# Altium project HU_revB.PrjPcb (part 4 of 4)

## Sheet PWR_SW.SchDoc
size A4; SheetNumber: 15; SheetTotal: 17
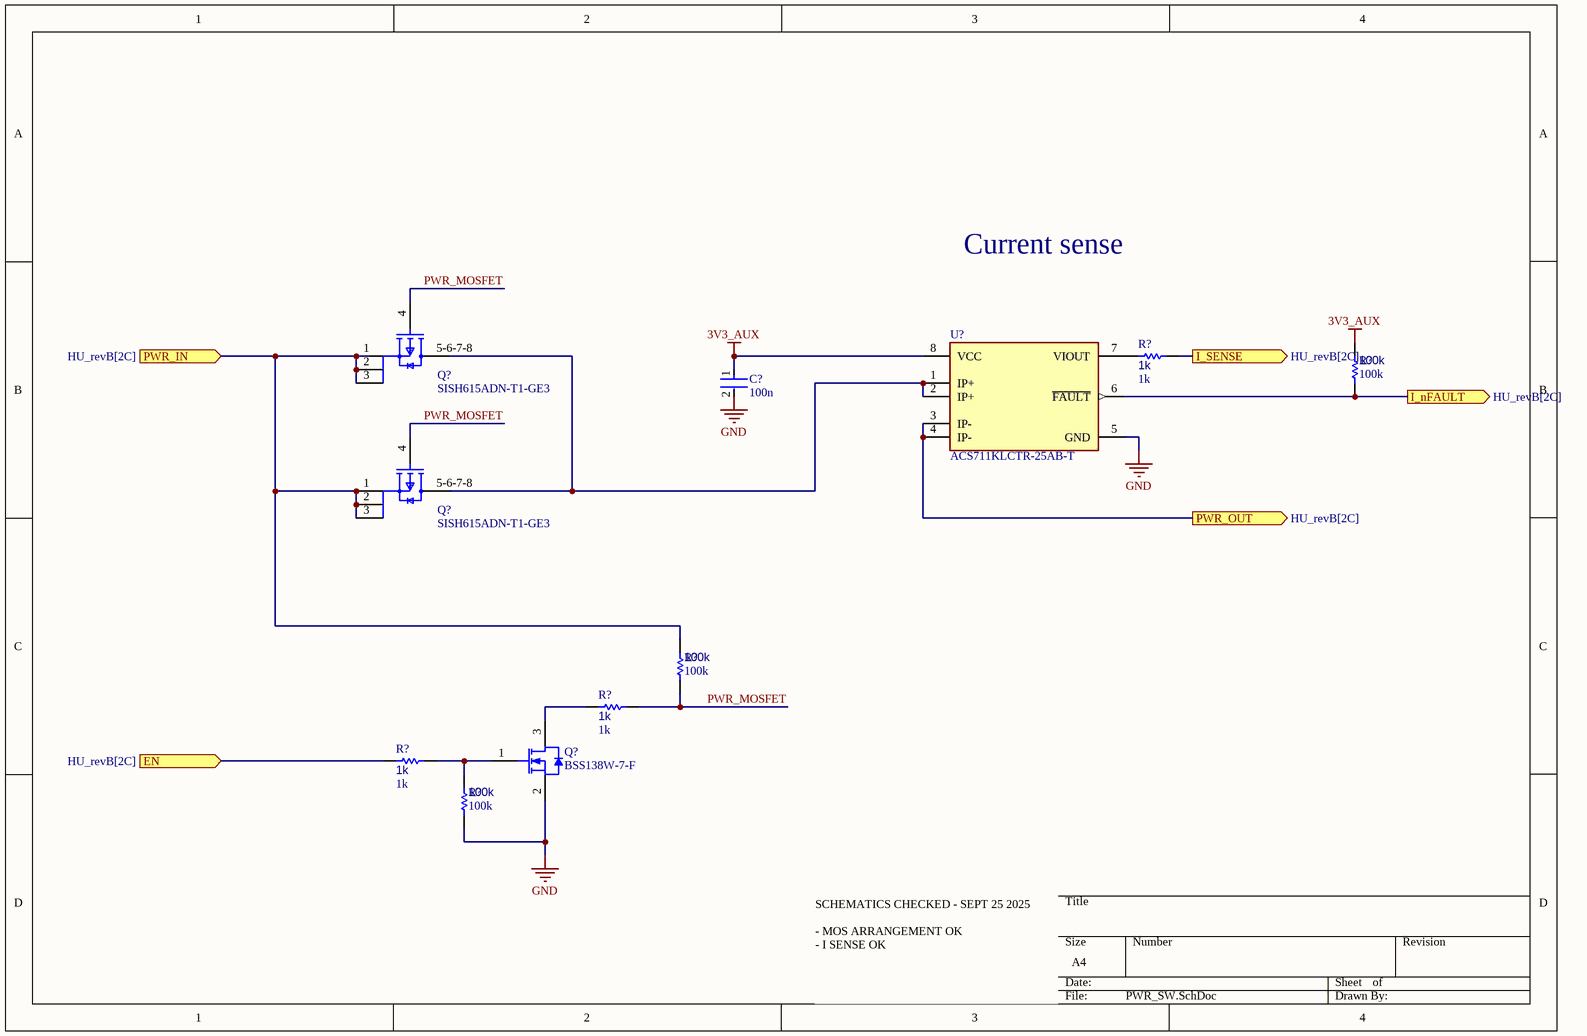
[diagram p19: PWR_SW.SchDoc]

### Parts
(Parts that share a designator on the sheet are numbered #1, #2 ... from top to bottom, then left to right.)
C86  100n  [FP-0402-L_1_0_0_05-W_0_5-IPC_A]
Q14  SISH615ADN-T1-GE3  [SISH615ADN-T1-GE3-Footprint-1]
Q15  SISH615ADN-T1-GE3  [SISH615ADN-T1-GE3-Footprint-1]
Q16  BSS138W-7-F  [DIOD-SOT323-3_V]
R89  1k  [R0603B]
R90  100k  [R0603B]
R92  1k  [R0603B]
R93  1k  [R0603B]
R94  100k  [R0603B]
R?#19  100k  [R0603B]
U12  ACS711KLCTR-25AB-T  [FP-LC-8-IPC_A]

### Ports
EN (in, see HU_revB[2C]), I_nFAULT (out, see HU_revB[2C]), I_SENSE (out, see HU_revB[2C]), PWR_IN (in, see HU_revB[2C]), PWR_OUT (out, see HU_revB[2C])

### Nets
3V3_AUX: C86.1 R90.2 U12.8(VCC)  [project net GPIO_VREF]
AMP_VCC: U12.3(IP-) U12.4(IP-) ; port PWR_OUT
GND: C86.2 Q16.2(S) R94.1 U12.5(GND)
AMP_I_SENSE: R89.1 ; port I_SENSE
PWR_MOSFET: Q14.4(G) Q15.4(G) R92.2 R?#19.1
NetF7_2: Q14.1(S) Q14.2(S) Q14.3(S) Q15.1(S) Q15.2(S) Q15.3(S) R?#19.2 ; port PWR_IN
NetQ14_5-6-7-8: Q14.5-6-7-8(D) Q15.5-6-7-8(D) U12.1(IP+) U12.2(IP+)
NetQ16_1: Q16.1(G) R93.2 R94.2
NetQ16_3: Q16.3(D) R92.1
NetR89_2: R89.2 U12.7(VIOUT)
NetR90_1: R90.1 U12.6(~{FAULT}) ; port I_nFAULT
NetR93_1: R93.1 ; port EN

### Notes on the sheet
- Current sense
- SCHEMATICS CHECKED - SEPT 25 2025
  - MOS ARRANGEMENT OK
  - I SENSE OK

### Library data of the parts
C86 = CMP-001-00058-1: as C55-C59 on sheet MCP2515_PINOUT; Min Operating Temperature: -55°C; Mounting Technology: Surface Mount; Pins: 2; Case/Package: 0402; RoHS Compliant: Yes; Max Operating Temperature: 85°C
Q14 Q15 = CMP-013-00018-2: Trans MOSFET P-CH 20V 22.1A 8-Pin PowerPAK 1212 EP T/R; Source: SISH615ADN-T1-GE3.SchLib; Design Item ID: CMP-013-00036-4; Component Type: Standard; Pins: 5
Q16 = CMP-2000-05968-1: N-Channel Enhancement Mode Mosfet, 50 V, 200 mA, -55 to 150 degC, 6-Pin SOT-323, RoHS, Tape and Reel; Typical Turn-Off Delay Time: 20ns; Number of Channels: 1Channel; Type: EnhancementModeFieldEffectTransistor; Brand: DiodesIncorporated; Vds - Drain-Source Breakdown Voltage: 75V; Vgs - Gate-Source Voltage: 20V; Rds On - Drain-Source Resistance: 1.4Ohms; Transistor Type: 1N-Channel; Configuration: Single; Unit Weight: 0.000212oz; Pd - Power Dissipation: 200mW; Id - Continuous Drain Current: 200mA; Forward Transconductance - Min: 0.1S; Manufacturer URL: http://www.diodes.com/; Series: BSS138; Package Description: 3-Pin Small Outline Transistor, Body 2 x 1.25 mm, Pitch 0.65 mm; Mounting Technology: SurfaceMount; Product Category: MOSFET; RoHS: True; Maximum Operating Temperature: +150C; Height: 1mm; Length: 2.2mm; Technology: Si; Width: 1.35mm; Datasheet URL: http://www.diodes.com/_files/datasheets/ds30206.pdf; Manufacturer: DiodesIncorporated; Package / Case: SOT-323-3; Typical Turn-On Delay Time: 20ns; Transistor Polarity: N-Channel; Factory Pack Quantity: 3000; Packaging: Reel; Product: MOSFETSmallSignal; Datasheet Version: Rev. 11-2, 09/2013; Package Reference: SOT323; Minimum Operating Temperature: -55C; Mounting Style: SMD/SMT; Channel Mode: Enhancement
R89 R90 R92-R94 R?#19 = CMP-009-00002-14: Resistor
  R?#104 R?#107 R?#108: Value: 1k
  R?#105 R?#106 R?#109: Value: 100k
U12 = CMP-1557-00015-2: SENSOR CURRENT HALL 25A AC/DC; Bandwidth: 100kHz; Min Supply Voltage: 3V; Polarity: Bidirectional; Max Supply Voltage: 5.5V; Max Supply Current: 5.5mA; Number of Channels: 1; Quiescent Current: 4mA; Sensitivity: 55mV/A; Accuracy: 4%; Linearity: 1%; Operating Supply Voltage: 3.3V; Response Time: 4.6us; Case/Package: SOIC; Min Operating Temperature: -40°C; RoHS Compliant: Yes; Length: 4.9mm; Package Quantity: 1; Number of Pins: 8; Width: 3.9mm; REACH SVHC: No SVHC; -3db Bandwidth: 100kHz; Series: -; Packaging: Tape and Reel; Max Operating Temperature: 125°C; Current Sensing: 25A; Height: 1.5mm; Frequency: 100kHz

## Sheet TS3USB221A_PINOUT.SchDoc
size A4; SheetNumber: 16; SheetTotal: 17
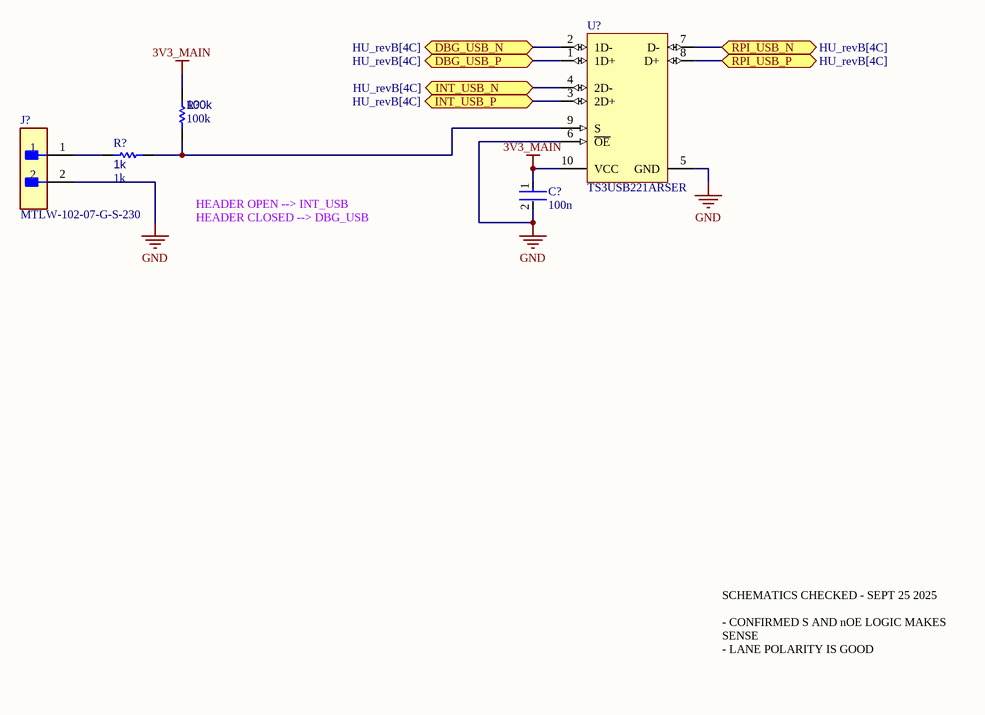
[diagram p20: TS3USB221A_PINOUT.SchDoc]

### Parts
(Parts that share a designator on the sheet are numbered #1, #2 ... from top to bottom, then left to right.)
C87  100n  [FP-0402-L_1_0_0_05-W_0_5-IPC_A]
J15  MTLW-102-07-G-S-230  [FP-MTLW-102-07-G-S-230-MFG]
R?#20  100k  [R0603B]
R?#21  1k  [R0603B]
U13  TS3USB221ARSER  [RSE0010A_V]

### Ports
DBG_USB_N (bidir, see HU_revB[4C]), DBG_USB_P (bidir, see HU_revB[4C]), INT_USB_N (bidir, see HU_revB[4C]), INT_USB_P (bidir, see HU_revB[4C]), RPI_USB_N (bidir, see HU_revB[4C]), RPI_USB_P (bidir, see HU_revB[4C])

### Nets
3V3_MAIN: C87.1 R?#20.2 U13.10(VCC)
GND: C87.2 J15.2 U13.5(GND) U13.6(~{OE})
DBG_USB_N: U13.2(1D-) ; port DBG_USB_N
DBG_USB_P: U13.1(1D+) ; port DBG_USB_P
USB2_N: U13.7(D-) ; port RPI_USB_N
USB2_P: U13.8(D+) ; port RPI_USB_P
NetJ15_1: J15.1 R?#21.2
NetR78_2: U13.4(2D-) ; port INT_USB_N
NetR81_2: U13.3(2D+) ; port INT_USB_P
NetR?#20_1: R?#20.1 R?#21.1 U13.9(S)

### Notes on the sheet
- HEADER OPEN --> INT_USB
  HEADER CLOSED --> DBG_USB
- SCHEMATICS CHECKED - SEPT 25 2025
  - CONFIRMED S AND nOE LOGIC MAKES SENSE
  - LANE POLARITY IS GOOD

### Library data of the parts
C87 = CMP-001-00058-1: as C55-C59 on sheet MCP2515_PINOUT; Min Operating Temperature: -55°C; Mounting Technology: Surface Mount; Pins: 2; Case/Package: 0402; RoHS Compliant: Yes; Max Operating Temperature: 85°C
J15 = CMP-02766-001053-1: CONN HEADER VERT 2POS 2.54MM; Max Current Rating: 3A; Number of Contacts: 2; Gender: Male; Housing Color: Black; Housing Material: Polymer; Radiation Hardening: No; Min Operating Temperature: -55°C; Contact Plating: Gold; Termination: Solder; Number of Rows: 1; Max Operating Temperature: 125°C; Contact Material: Bronze; Pitch: 2.54mm; Depth: 2.48mm; Length: 5.08mm; Orientation: Straight; Packaging: Bulk
R?#20 R?#21 = CMP-009-00002-14: Resistor
  R?#110: Value: 100k
  R?#111: Value: 1k
U13 = CMP-0309-00017-2: ESD Protected,High-Speed USB 2.0 (480-Mbps) 1:2 Multiplexer / Demultiplexer Switch, 1:2 Mux / Demux, 6 ohm RON, 2.5 to 3.3V, -40 to 85 degC, 10-Pin UQFN (RSE), Green (RoHS & no Sb/Br); Manufacturer: Texas Instruments; tpd max(ns): 0.25; RON Mis-match(Max)(Ohms): 0.2; OFF Time(Max)(ns): 12; Architecture: "1","2 mux/demux"; IL OFF(Max)(nA): 2; SubFamily: USB Switch; ESD HBM(kV): +/-7; ron(max)(ohms): 6; ON Time(Max)(ns): 30; Bandwidth(MHz): 900; RON Flatness(Max)(Ohms): 1; Vcc range(V): 2.3 to 3.6; Mounting Technology: Surface Mount; ComponentLink2URL: http://www.ti.com/lit/ml/mpqf186c/mpqf186c.pdf; PackageDescription: 10-Leads Plastic Quad Flatpack No-Lead, 2 x 1.5 x 0.55 mm Body, 0.5 mm Pitch; ComponentLink1URL: http://www.ti.com/general/docs/lit/getliterature.tsp?genericPartNumber=TS3USB221A&fileType=pdf; PackageReference: RSE0010A; ComponentLink2Description: Package Specification; PartNumber: TS3USB221ARSER; Code_JEDEC: MO-288-UEFD; DatasheetVersion: SCDS277; ComponentLink1Description: Datasheet; Eco-Plan: Green (RoHS & no Sb/Br); Number of Channels: 2; PackageVersion: revD, Jan-2011; ICC(uA): 30

## Sheet MAX_M10M_PINOUT.SchDoc
size B; SheetNumber: 17; SheetTotal: 17
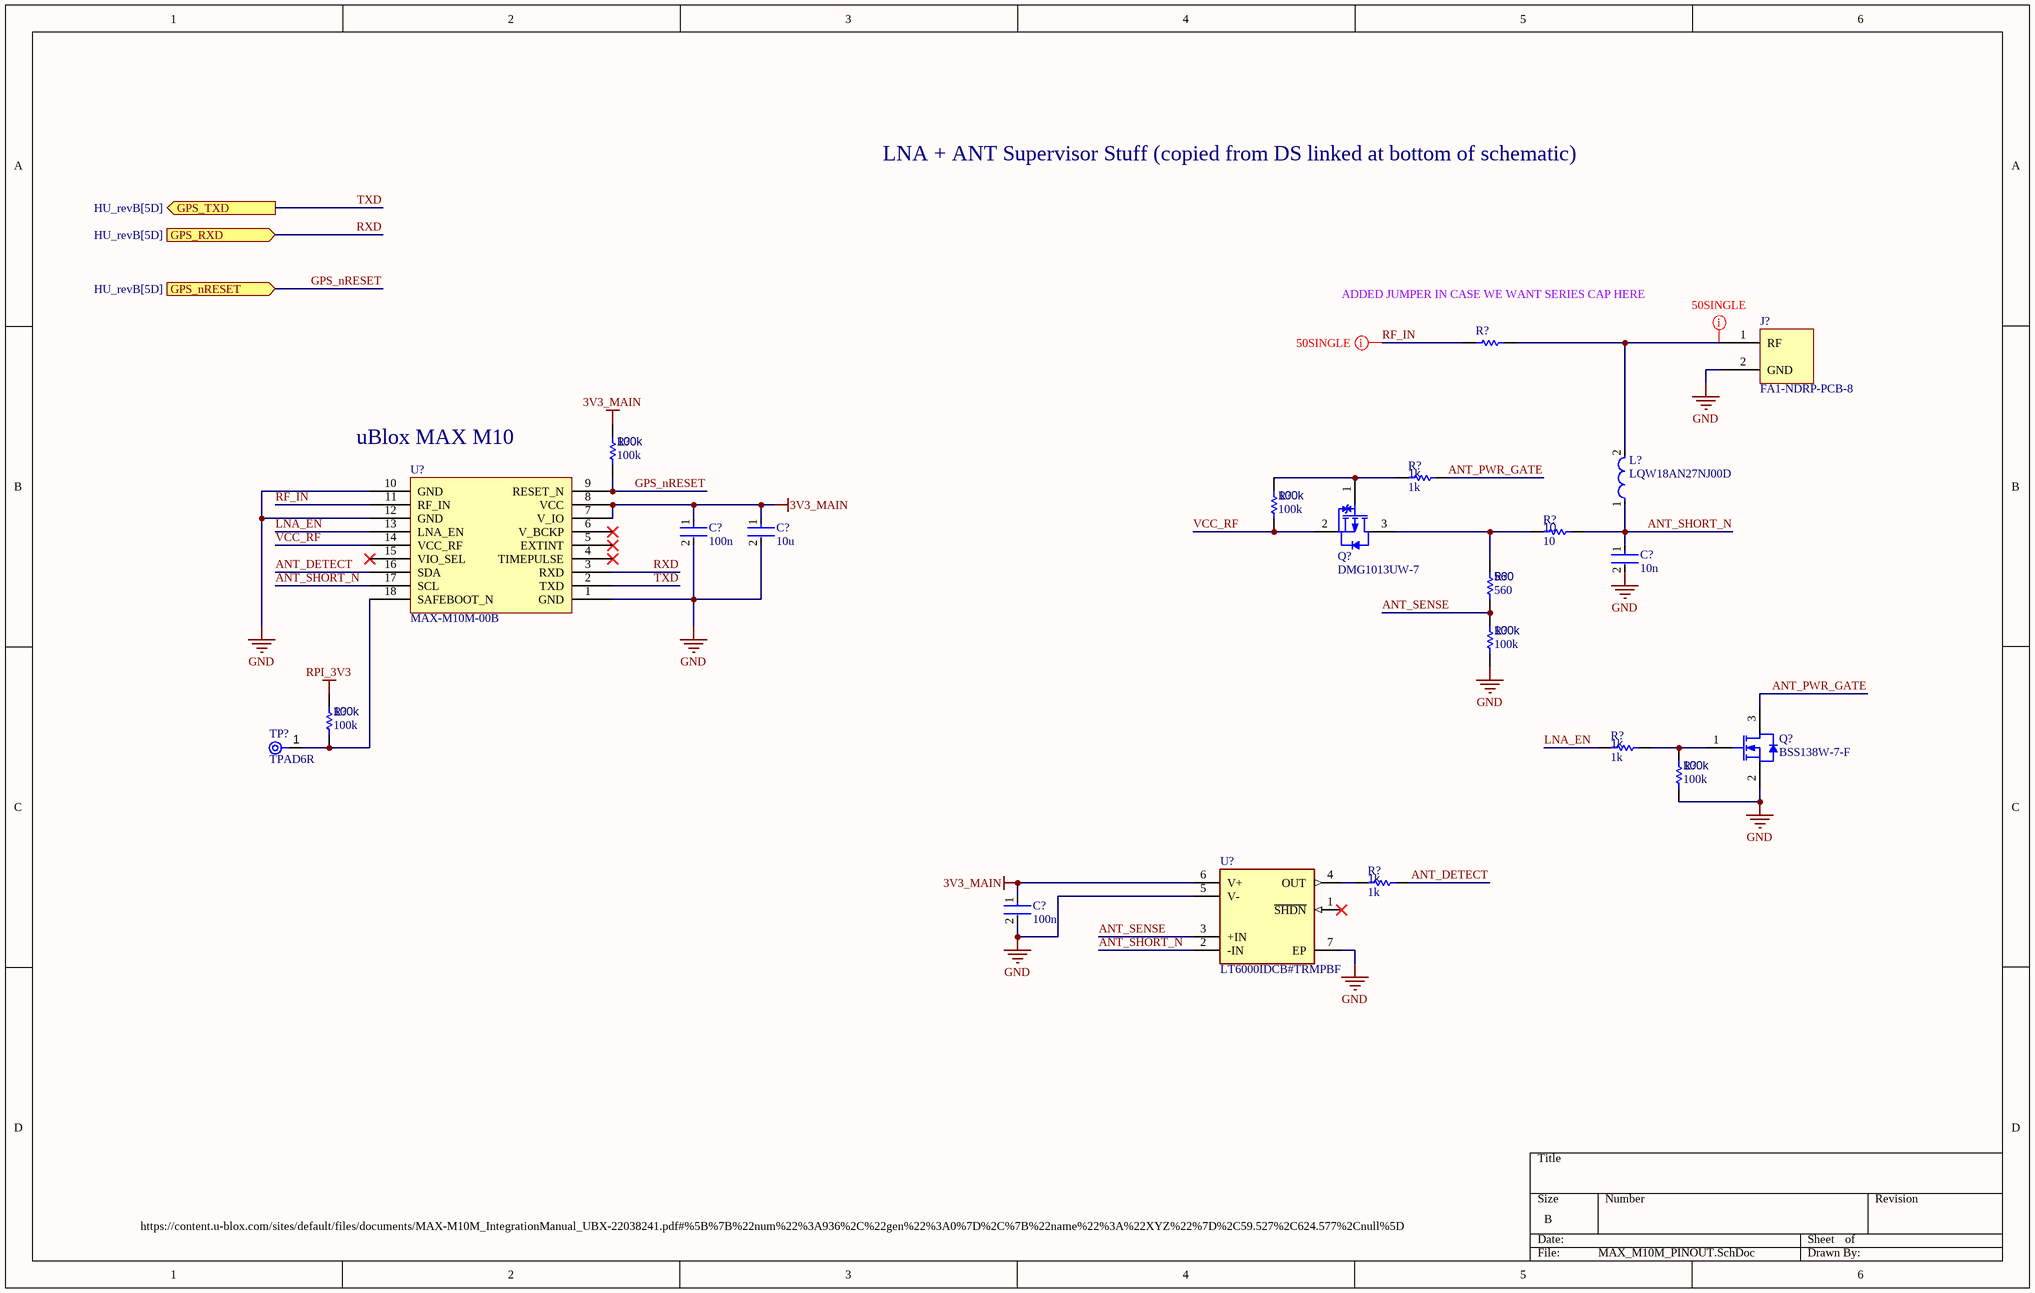
[diagram p21: MAX_M10M_PINOUT.SchDoc]

### Parts
(Parts that share a designator on the sheet are numbered #1, #2 ... from top to bottom, then left to right.)
C88  100n  [FP-0402-L_1_0_0_05-W_0_5-IPC_A]
C89  10u  [FP-0402-L_1_0_0_05-W_0_5-IPC_A]
C91  100n  [FP-0402-L_1_0_0_05-W_0_5-IPC_A]
C?#20  10n  [FP-0402-L_1_0_0_05-W_0_5-IPC_A]
J17  FA1-NDRP-PCB-8  [FA1-NDRP-PCB-8-Footprint-1]
L?#3  LQW18AN27NJ00D  [FP-LQW18AN_00-MFG]
Q?#3  DMG1013UW-7  [DIOD-SOT323-3_V]
Q?#4  BSS138W-7-F  [DIOD-SOT323-3_V]
R95  100k  [R0603B]
R103  100k  [R0603B]
R106  1k  [R0603B]
R?#22  0402 JUMPER  [RESC1005X40X25ML05T05]  (value not drawn)
R?#23  1k  [R0603B]
R?#24  100k  [R0603B]
R?#25  10  [R0603B]
R?#26  560  [R0603B]
R?#27  100k  [R0603B]
R?#28  1k  [R0603B]
R?#29  100k  [R0603B]
TP4  TPAD6R  [New footprint 1]
U14  MAX-M10M-00B  [MAX-M10M-00B-Footprint-1]
U15  LT6000IDCB#TRMPBF  [FP-DCB-6-05-08-1715-MFG]

### Ports
GPS_nRESET (in, see HU_revB[5D]), GPS_RXD (in, see HU_revB[5D]), GPS_TXD (out, see HU_revB[5D])

### Nets
3V3_MAIN: C88.1 C89.1 C91.1 R95.1 U14.7(V_IO) U14.8(VCC) U15.6(V+)
GND: C88.2 C89.2 C91.2 C?#20.2 J17.2(GND) Q?#4.2(S) R?#27.2 R?#29.2 U14.1(GND) U14.10(GND) U14.12(GND) U15.5(V-) U15.7(EP)
RPI_3V3: R103.1
ANT_DETECT: R106.2 U14.16(SDA)
ANT_PWR_GATE: Q?#4.3(D) R?#23.2
ANT_SENSE: R?#26.2 R?#27.1 U15.3(+IN)
ANT_SHORT_N: C?#20.1 L?#3.1 R?#25.2 U14.17(SCL) U15.2(-IN)
GPS_nRESET: R95.2 U14.9(RESET_N) ; port GPS_nRESET
LNA_EN: R?#28.1 U14.13(LNA_EN)
RF_IN: R?#22.1 U14.11(RF_IN)
RXD: U14.3(RXD) ; port GPS_RXD
TXD: U14.2(TXD) ; port GPS_TXD
VCC_RF: Q?#3.2(S) R?#24.2 U14.14(VCC_RF)
NetJ17_1: J17.1(RF) L?#3.2 R?#22.2
NetQ?#3_1: Q?#3.1(G) R?#23.1 R?#24.1
NetQ?#3_3: Q?#3.3(D) R?#25.1 R?#26.1
NetQ?#4_1: Q?#4.1(G) R?#28.2 R?#29.1
NetR103_2: R103.2 TP4.1(TP) U14.18(SAFEBOOT_N)
NetR106_1: R106.1 U15.4(OUT)

Not connected (* = marked no-connect by the designer): U14 4(TIMEPULSE)* 5(EXTINT)* 6(V_BCKP)* 15(VIO_SEL)*; U15 1(~{SHDN})*

### Layout directives
net class 50SINGLE: NetJ17_1, RF_IN

### Notes on the sheet
- LNA + ANT Supervisor Stuff (copied from DS linked at bottom of schematic)
- (near R?#22) ADDED JUMPER IN CASE WE WANT SERIES CAP HERE
- (near U14) uBlox MAX M10
- https://content.u-blox.com/sites/default/files/documents/MAX-M10M_IntegrationManual_UBX-22038241.pdf#%5B%7B%22num%22%3A936%2C%22gen%22%3A0%7D%2C%7B%22name%22%3A%22XYZ%22%7D%2C59.527%2C624.577%2Cnull%5D

### Library data of the parts
C88 C89 C91 C?#20 = CMP-001-00058-1: as C55-C59 on sheet MCP2515_PINOUT; Min Operating Temperature: -55°C; Mounting Technology: Surface Mount; Pins: 2; Case/Package: 0402; RoHS Compliant: Yes; Max Operating Temperature: 85°C
  C?#106 C?#109: Value: 100n
  C?#107: Value: 10u
  C?#108: Value: 10n
J17 = CMP-002-00054-1: RF F Connector, Male, Board Mount, Solder Terminal, Plug; Connector Type: RF F CONNECTOR; RoHS Compliant: Yes; Mounting Technology: Board
L?#3 = CMP-06042-013840-1: Wire Wound RF Inductor 27nH ±5% 440mA 0.21Ω 0603 (1608); Shielding: Unshielded; Test Frequency: 100MHz; Q Factor: 40; Self Resonant Frequency: 3.7GHz; DC Resistance (DCR): 210mR; Core Material: Non-Magnetic; Depth: 1mm; Min Operating Temperature: -55°C; Package Quantity: 4000; Inductance: 27nH; Case Code (Metric): 1608; Height - Seated (Max): 0.039inch; Resistor Type: Wirewound; Max DC Current: 440mA; Tolerance: 5%; Length: 1.6mm; Mount: Surface Mount; DC Current: 440mA; Packaging: Tape and Reel; Lead Free: Lead Free; Case Code (Imperial): 0603; Current Rating: 440mA; Width: 0.8mm; Max Operating Temperature: 125°C; Termination: SMD/SMT; Weight: 0.000106oz; Radiation Hardening: No; Height: 0.8mm; Case/Package: 0603; Military Standard: Not
Q?#3 = CMP-2000-06170-1: P-Channel Enhancement Mode MOSFET, 310 mW, 20 V, -55 to 150 degC, 3-Pin SOT-323, RoHS, Tape and Reel; Manufacturer: Diodes Inc; Qg Gate Charge: 0.622nC; Drain-Source On Resistance-Max: 750mO; Rated Power Dissipation: 310mW; Drain-to-Source Voltage [Vdss]: 20V; Package Reference: SOT323; Datasheet Version: Rev. 3-2, 09/2013; Package Description: 3-Pin Small Outline Transistor, Body 2 x 1.25 mm, Pitch 0.65 mm; Mounting Technology: SurfaceMount; Manufacturer URL: http://www.diodes.com/; Datasheet URL: http://www.diodes.com/_files/datasheets/ds31861.pdf; Channel Type: P-Channel
Q?#4 = CMP-2000-05968-1: as Q16 on sheet PWR_SW; Manufacturer URL: http://www.diodes.com/; Series: BSS138; Package Description: 3-Pin Small Outline Transistor, Body 2 x 1.25 mm, Pitch 0.65 mm; Mounting Technology: SurfaceMount; Product Category: MOSFET; RoHS: True; Maximum Operating Temperature: +150C; Height: 1mm; Length: 2.2mm; Technology: Si; Width: 1.35mm; Datasheet URL: http://www.diodes.com/_files/datasheets/ds30206.pdf; Manufacturer: DiodesIncorporated; Package / Case: SOT-323-3; Typical Turn-On Delay Time: 20ns; Transistor Polarity: N-Channel; Factory Pack Quantity: 3000; Packaging: Reel; Product: MOSFETSmallSignal; Datasheet Version: Rev. 11-2, 09/2013; Package Reference: SOT323; Minimum Operating Temperature: -55C; Mounting Style: SMD/SMT; Channel Mode: Enhancement
R95 R103 R106 R?#23-R?#29 = CMP-009-00002-14: Resistor; Pins: 2; Component Type: Standard; Design Item ID: CMP-009-00206-2; Source: 0402jump.SchLib; Value: 0402 JUMPER
R?#22 = CMP-009-00118-2: READ THE NAME
  R?#113 R?#115 R?#118 R?#119 R?#121: Value: 100k
  R?#114 R?#120 R?#122: Value: 1k
  R?#116: Value: 10
  R?#117: Value: 560
TP4 = CMP-00025-2: Test Point .6mm
U14 = CMP-010-00031-2: Gnss Lcc Rx Mod, Rom, Crystal
U15 = CMP-09116-000039-1: IC OPAMP GP 1 CIRCUIT 6DFN; Number of Elements: 1; Power Supply Rejection Ratio (PSRR): 86dB; Output Current per Channel: 10mA; Gain Bandwidth Product: 60kHz; Operating Supply Current: 20uA; Input Bias Current: 12nA; Voltage Gain: 120dB; Max Supply Voltage: 18V; Input Offset Voltage (Vos): 1.2mV; Min Supply Voltage: 1.8V; Slew Rate: 0.018V/µs; Common Mode Rejection Ratio: 68dB; Packaging: Tape and Reel; Mount: Surface Mount; Case/Package: DFN; Max Operating Temperature: 85°C; Number of Pins: 6; Number of Amplifiers: 1; REACH SVHC: No SVHC; Unity Gain Bandwidth Product: 60kHz; Bandwidth: 60kHz; Lead Free: Lead Free; Number of Circuits: 1; Min Operating Temperature: -40°C; Package Quantity: 1

## Nets that join several sheets
3V3_MAIN: TCAN1146_PWR_MGMT (C10#1.1 U8.5), RPI_CM5_PINOUT (D6.2 D6.3 J?#2.84 J?#2.86), SD (Q10.5 Q10.6 R71.2), TS3USB221A_PINOUT (C87.1 R?#20.2 U13.10), MAX_M10M_PINOUT (7 pins)
5V_AUX: DISP_0 (F9_DISP_0.1 Q13_DISP_0.5 Q13_DISP_0.6 R74_DISP_0.2), DISP_1 (F9_DISP_1.1 Q13_DISP_1.5 Q13_DISP_1.6 R74_DISP_1.2)
5V_MAIN: HU_revB (6 pins), TCAN1146_PWR_MGMT (C9#1.1 U8.3), RPI_CM5_PINOUT (6 pins), 5V_REG (R46.2 U5.3 U5.4)
AMP_VCC: HU_revB (J?#1.3), PWR_SW (U12.3 U12.4)
BAT_12V: HU_revB (J?#1.1 J?#1.2 J?#1.13 J?#1.14), TCAN1146_PWR_MGMT (F?#1.1)
GND: HU_revB (47 pins), TCAN1146_PWR_MGMT (19 pins), RPI_CM5_PINOUT (57 pins), 5V_REG (15 pins), NVME (33 pins), MCP2515_PINOUT (8 pins), ADC108S022_PINOUT (11 pins), SD (9 pins), USB (15 pins), DISP_0 (13 pins), TUSB2036_PINOUT (23 pins), DISP_1 (13 pins), 3V3_REG (16 pins), GMSL_DESERIALIZER (43 pins), PWR_SW (C86.2 Q16.2 R94.1 U12.5), TS3USB221A_PINOUT (C87.2 J15.2 U13.5 U13.6), MAX_M10M_PINOUT (13 pins)
GPIO_VREF: HU_revB (R23.2 R24.2), TCAN1146_PWR_MGMT (C8#1.1 R26.2 U7.8), RPI_CM5_PINOUT (J?#2.78), 5V_REG (C36.1 R40.1 R45.2 U5.8), NVME (F8.1), MCP2515_PINOUT (5 pins), ADC108S022_PINOUT (7 pins), USB (5 pins), TUSB2036_PINOUT (11 pins), 3V3_REG (7 pins), GMSL_DESERIALIZER (10 pins), PWR_SW (C86.1 R90.2 U12.8)
PWR_OUT: HU_revB (F3.1 F5.1 F6.1 F7.1), TCAN1146_PWR_MGMT (R29.2 U7.3 U7.4)
ADC_MISO: RPI_CM5_PINOUT (J?#2.26), ADC108S022_PINOUT (U9.15 U10.15)
ADC_MOSI: RPI_CM5_PINOUT (J?#2.27), ADC108S022_PINOUT (U9.14 U10.14)
ADC_SCLK: RPI_CM5_PINOUT (J?#2.25), ADC108S022_PINOUT (U9.16 U10.16)
AMP_I_SENSE: ADC108S022_PINOUT (U10.4), PWR_SW (R89.1)
CAM_GPIO0: RPI_CM5_PINOUT (J?#2.97), GMSL_DESERIALIZER (R2.1 U?#3.11)
CAN_N: HU_revB (J1.29), TCAN1146_PWR_MGMT (C12#1.1 D3.2 L1#1.4 R35.2)
CAN_P: HU_revB (J1.28), TCAN1146_PWR_MGMT (C14#1.2 D3.1 L1#1.1 R37.1)
CH0_FAN_TACH: HU_revB (J3.4), RPI_CM5_PINOUT (J?#2.46)
CH0_GPIO: HU_revB (R18.1), RPI_CM5_PINOUT (J?#2.31)
CH1_FAN_TACH: HU_revB (J4.4), RPI_CM5_PINOUT (J?#2.48)
CH1_GPIO: HU_revB (R21.1), RPI_CM5_PINOUT (J?#2.28)
CKB_N: RPI_CM5_PINOUT (J?#3.187), GMSL_DESERIALIZER (U1.46)
CKB_P: RPI_CM5_PINOUT (J?#3.189), GMSL_DESERIALIZER (U1.45)
CONF_SCL: RPI_CM5_PINOUT (J?#2.80), GMSL_DESERIALIZER (U?#3.29)
CONF_SDA: RPI_CM5_PINOUT (J?#2.82), GMSL_DESERIALIZER (U?#3.28)
DA0_N: RPI_CM5_PINOUT (J?#3.115), GMSL_DESERIALIZER (U?#3.32)
DA0_P: RPI_CM5_PINOUT (J?#3.117), GMSL_DESERIALIZER (U?#3.31)
DA1_N: RPI_CM5_PINOUT (J?#3.121), GMSL_DESERIALIZER (U?#3.36)
DA1_P: RPI_CM5_PINOUT (J?#3.123), GMSL_DESERIALIZER (U?#3.35)
DA2_N: RPI_CM5_PINOUT (J?#3.133), GMSL_DESERIALIZER (U?#3.38)
DA2_P: RPI_CM5_PINOUT (J?#3.135), GMSL_DESERIALIZER (U?#3.37)
DA3_N: RPI_CM5_PINOUT (J?#3.139), GMSL_DESERIALIZER (U?#3.42)
DA3_P: RPI_CM5_PINOUT (J?#3.141), GMSL_DESERIALIZER (U?#3.41)
DB0_N: RPI_CM5_PINOUT (J?#3.175), GMSL_DESERIALIZER (U1.44)
DB0_P: RPI_CM5_PINOUT (J?#3.177), GMSL_DESERIALIZER (U1.43)
DB1_N: RPI_CM5_PINOUT (J?#3.181), GMSL_DESERIALIZER (U1.48)
DB1_P: RPI_CM5_PINOUT (J?#3.183), GMSL_DESERIALIZER (U1.47)
DB2_N: RPI_CM5_PINOUT (J?#3.193), GMSL_DESERIALIZER (U1.50)
DB2_P: RPI_CM5_PINOUT (J?#3.195), GMSL_DESERIALIZER (U1.49)
DB3_N: RPI_CM5_PINOUT (J?#3.194), GMSL_DESERIALIZER (U1.54)
DB3_P: RPI_CM5_PINOUT (J?#3.196), GMSL_DESERIALIZER (U1.53)
DBG_USB_N: HU_revB (J7.A7 J7.B7), TS3USB221A_PINOUT (U13.2)
DBG_USB_P: HU_revB (J7.A6 J7.B6), TS3USB221A_PINOUT (U13.1)
DIGI_USB_N: DISP_0 (J?_DISP_0.2), TUSB2036_PINOUT (C77.1 R86.1)
DIGI_USB_N: TUSB2036_PINOUT (C74.1 R80.1), DISP_1 (J?_DISP_1.2)
DIGI_USB_P: DISP_0 (J?_DISP_0.3), TUSB2036_PINOUT (C76.1 R83.1)
DIGI_USB_P: TUSB2036_PINOUT (C72.1 R75.1), DISP_1 (J?_DISP_1.3)
EEPROM_nWP: HU_revB (P1.1), RPI_CM5_PINOUT (J?#2.20)
ETH_SYNC: HU_revB (P1.13), RPI_CM5_PINOUT (J?#2.18)
FAN_PWM: HU_revB (J2.2 R16.2), RPI_CM5_PINOUT (J?#2.19)
FAN_TACHO: HU_revB (J2.4), RPI_CM5_PINOUT (J?#2.16)
HDMI0_CEC: RPI_CM5_PINOUT (J?#3.151), DISP_0 (J13_DISP_0.13)
HDMI0_CK_N: RPI_CM5_PINOUT (J?#3.190), DISP_0 (J13_DISP_0.12)
HDMI0_CK_P: RPI_CM5_PINOUT (J?#3.188), DISP_0 (J13_DISP_0.10)
HDMI0_D0_N: RPI_CM5_PINOUT (J?#3.184), DISP_0 (J13_DISP_0.9)
HDMI0_D0_P: RPI_CM5_PINOUT (J?#3.182), DISP_0 (J13_DISP_0.7)
HDMI0_D1_N: RPI_CM5_PINOUT (J?#3.178), DISP_0 (J13_DISP_0.6)
HDMI0_D1_P: RPI_CM5_PINOUT (J?#3.176), DISP_0 (J13_DISP_0.4)
HDMI0_D2_N: RPI_CM5_PINOUT (J?#3.172), DISP_0 (J13_DISP_0.3)
HDMI0_D2_P: RPI_CM5_PINOUT (J?#3.170), DISP_0 (J13_DISP_0.1)
HDMI0_HOTP: RPI_CM5_PINOUT (J?#3.153), DISP_0 (J13_DISP_0.19)
HDMI0_SCL: RPI_CM5_PINOUT (J?#3.200), DISP_0 (J13_DISP_0.15)
HDMI0_SDA: RPI_CM5_PINOUT (J?#3.199), DISP_0 (J13_DISP_0.16)
HDMI1_CEC: RPI_CM5_PINOUT (J?#3.149), DISP_1 (J13_DISP_1.13)
HDMI1_CK_N: RPI_CM5_PINOUT (J?#3.166), DISP_1 (J13_DISP_1.12)
HDMI1_CK_P: RPI_CM5_PINOUT (J?#3.164), DISP_1 (J13_DISP_1.10)
HDMI1_D0_N: RPI_CM5_PINOUT (J?#3.160), DISP_1 (J13_DISP_1.9)
HDMI1_D0_P: RPI_CM5_PINOUT (J?#3.158), DISP_1 (J13_DISP_1.7)
HDMI1_D1_N: RPI_CM5_PINOUT (J?#3.154), DISP_1 (J13_DISP_1.6)
HDMI1_D1_P: RPI_CM5_PINOUT (J?#3.152), DISP_1 (J13_DISP_1.4)
HDMI1_D2_N: RPI_CM5_PINOUT (J?#3.148), DISP_1 (J13_DISP_1.3)
HDMI1_D2_P: RPI_CM5_PINOUT (J?#3.146), DISP_1 (J13_DISP_1.1)
HDMI1_HOTP: RPI_CM5_PINOUT (J?#3.143), DISP_1 (J13_DISP_1.19)
HDMI1_SCL: RPI_CM5_PINOUT (J?#3.147), DISP_1 (J13_DISP_1.15)
HDMI1_SDA: RPI_CM5_PINOUT (J?#3.145), DISP_1 (J13_DISP_1.16)
nBT_INH: HU_revB (P1.5), RPI_CM5_PINOUT (J?#2.91)
NetC?#1_1: HU_revB (F3.2), 5V_REG (5 pins)
NetC?#12_1: HU_revB (F5.2), 3V3_REG (5 pins)
NetD45_1: TCAN1146_PWR_MGMT (D45.1 R29.1 R31.2), ADC108S022_PINOUT (U9.4)
NetF7_2: HU_revB (F7.2), PWR_SW (7 pins)
nETH_G_LED: HU_revB (J6.L1), RPI_CM5_PINOUT (J?#2.17)
nETH_Y_LED: HU_revB (J6.L3), RPI_CM5_PINOUT (J?#2.15)
NetR40_2: 5V_REG (R40.2 R43.2), ADC108S022_PINOUT (U9.8)
NetR44_1: 5V_REG (R44.1), ADC108S022_PINOUT (U9.7)
NetR46_1: 5V_REG (R46.1 R47.2), ADC108S022_PINOUT (U9.6)
NetR63_1: TCAN1146_PWR_MGMT (R63.1), ADC108S022_PINOUT (U9.5)
NetR78_2: TUSB2036_PINOUT (R78.2), TS3USB221A_PINOUT (U13.4)
NetR81_2: TUSB2036_PINOUT (R81.2), TS3USB221A_PINOUT (U13.3)
NetR?#11_2: ADC108S022_PINOUT (U9.11), 3V3_REG (R?#11.2 R?#14.2)
NetR?#15_1: ADC108S022_PINOUT (U9.10), 3V3_REG (R?#15.1)
NetR?#17_1: ADC108S022_PINOUT (U9.9), 3V3_REG (R?#17.1 R?#18.2)
NetU6_1: TCAN1146_PWR_MGMT (U8.1), MCP2515_PINOUT (U6.1)
NetU6_2: TCAN1146_PWR_MGMT (U8.4), MCP2515_PINOUT (U6.2)
nPWR_BTN: HU_revB (P1.7), RPI_CM5_PINOUT (J?#2.92)
nRPI_BOOT: HU_revB (P1.9), RPI_CM5_PINOUT (J?#2.93)
nWIFI_INH: HU_revB (P1.3), RPI_CM5_PINOUT (J?#2.89)
PCIE_nCLKREQ: RPI_CM5_PINOUT (J?#3.102), NVME (R49.2)
PCIE_nRST: RPI_CM5_PINOUT (J?#3.109), NVME (R48.2)
PCIE_nWAKE: RPI_CM5_PINOUT (J?#3.104), NVME (R50.2)
PCIE_PWR_EN: RPI_CM5_PINOUT (J?#3.106), NVME (R?#3.2)
PCIE_RX0_N: RPI_CM5_PINOUT (J?#3.118), NVME (J?#6.43)
PCIE_RX0_P: RPI_CM5_PINOUT (J?#3.116), NVME (J?#6.41)
PCIE_TX0_N: RPI_CM5_PINOUT (J?#3.124), NVME (J?#6.49)
PCIE_TX0_P: RPI_CM5_PINOUT (J?#3.122), NVME (J?#6.47)
PMIC_EN: HU_revB (P1.11), RPI_CM5_PINOUT (J?#2.99)
PoC_A: HU_revB (J5.4), GMSL_DESERIALIZER (C1.2 D1#2.1 D1#2.10 L3.2)
PoC_B: HU_revB (J5.3), GMSL_DESERIALIZER (C2.2 D1#2.5 D1#2.6 L6.2)
PoC_C: HU_revB (J5.2), GMSL_DESERIALIZER (C5.2 D2#2.1 D2#2.10 L12.2)
PoC_D: HU_revB (J5.1), GMSL_DESERIALIZER (C6.2 D2#2.5 D2#2.6 L9.2)
PoC_PWR: HU_revB (F6.2), GMSL_DESERIALIZER (F10.1 F11.1 F12.1 F13.1)
SD_CLK: RPI_CM5_PINOUT (J?#2.57), SD (SD1.5)
SD_CMD: RPI_CM5_PINOUT (J?#2.62), SD (SD1.3)
SD_DAT0: RPI_CM5_PINOUT (J?#2.63), SD (SD1.7)
SD_DAT1: RPI_CM5_PINOUT (J?#2.67), SD (SD1.8)
SD_DAT2: RPI_CM5_PINOUT (J?#2.69), SD (SD1.1)
SD_DAT3: RPI_CM5_PINOUT (J?#2.61), SD (SD1.2)
SD_PWR_EN: RPI_CM5_PINOUT (J?#2.75), SD (R?#5.2)
SPI0_MISO: RPI_CM5_PINOUT (J?#2.40), MCP2515_PINOUT (U6.15)
SPI0_MOSI: RPI_CM5_PINOUT (J?#2.44), MCP2515_PINOUT (U6.14)
SPI0_nCS0: RPI_CM5_PINOUT (J?#2.39), MCP2515_PINOUT (U6.16)
SPI0_SCLK: RPI_CM5_PINOUT (J?#2.38), MCP2515_PINOUT (U6.13)
SPI1_nCS0: RPI_CM5_PINOUT (J?#2.49), ADC108S022_PINOUT (U9.1)
SPI1_nCS1: RPI_CM5_PINOUT (J?#2.50), ADC108S022_PINOUT (U10.1)
SPI3_MISO: TCAN1146_PWR_MGMT (U8.11), RPI_CM5_PINOUT (J?#2.34)
SPI3_MOSI: TCAN1146_PWR_MGMT (U8.6), RPI_CM5_PINOUT (J?#2.30)
SPI3_nCS0: TCAN1146_PWR_MGMT (U8.14), RPI_CM5_PINOUT (J?#2.54)
SPI3_SCLK: TCAN1146_PWR_MGMT (U8.8), RPI_CM5_PINOUT (J?#2.37)
TRD0_N: HU_revB (J6.P3), RPI_CM5_PINOUT (D4.1 J?#2.10)
TRD0_P: HU_revB (J6.P2), RPI_CM5_PINOUT (D4.2 J?#2.12)
TRD1_N: HU_revB (J6.P5), RPI_CM5_PINOUT (D4.5 J?#2.6)
TRD1_P: HU_revB (J6.P4), RPI_CM5_PINOUT (D4.4 J?#2.4)
TRD2_N: HU_revB (J6.P8), RPI_CM5_PINOUT (D5.1 J?#2.9)
TRD2_P: HU_revB (J6.P7), RPI_CM5_PINOUT (D5.2 J?#2.11)
TRD3_N: HU_revB (J6.P10), RPI_CM5_PINOUT (D5.5 J?#2.5)
TRD3_P: HU_revB (J6.P9), RPI_CM5_PINOUT (D5.4 J?#2.3)
USB2_CC1: HU_revB (J7.A5), RPI_CM5_PINOUT (J?#2.94)
USB2_CC2: HU_revB (J7.B5), RPI_CM5_PINOUT (J?#2.96)
USB2_N: RPI_CM5_PINOUT (J?#3.103), TS3USB221A_PINOUT (U13.7)
USB2_P: RPI_CM5_PINOUT (J?#3.105), TS3USB221A_PINOUT (U13.8)
USB3_0_D_N: RPI_CM5_PINOUT (J?#3.136), USB (J11.2)
USB3_0_D_P: RPI_CM5_PINOUT (J?#3.134), USB (J11.3)
USB3_0_RX_N: RPI_CM5_PINOUT (J?#3.128), USB (J11.5)
USB3_0_RX_P: RPI_CM5_PINOUT (J?#3.130), USB (J11.6)
USB3_0_TX_N: RPI_CM5_PINOUT (J?#3.140), USB (J11.8)
USB3_0_TX_P: RPI_CM5_PINOUT (J?#3.142), USB (J11.9)
USB3_1_D_N: RPI_CM5_PINOUT (J?#3.165), USB (J12.2)
USB3_1_D_P: RPI_CM5_PINOUT (J?#3.163), USB (J12.3)
USB3_1_RX_N: RPI_CM5_PINOUT (J?#3.157), USB (J12.5)
USB3_1_RX_P: RPI_CM5_PINOUT (J?#3.159), USB (J12.6)
USB3_1_TX_N: RPI_CM5_PINOUT (J?#3.169), USB (J12.8)
USB3_1_TX_P: RPI_CM5_PINOUT (J?#3.171), USB (J12.9)
VBUS_EN: RPI_CM5_PINOUT (J?#3.111), USB (R73.2)